# Altium project MK32_DSD.PrjPcb
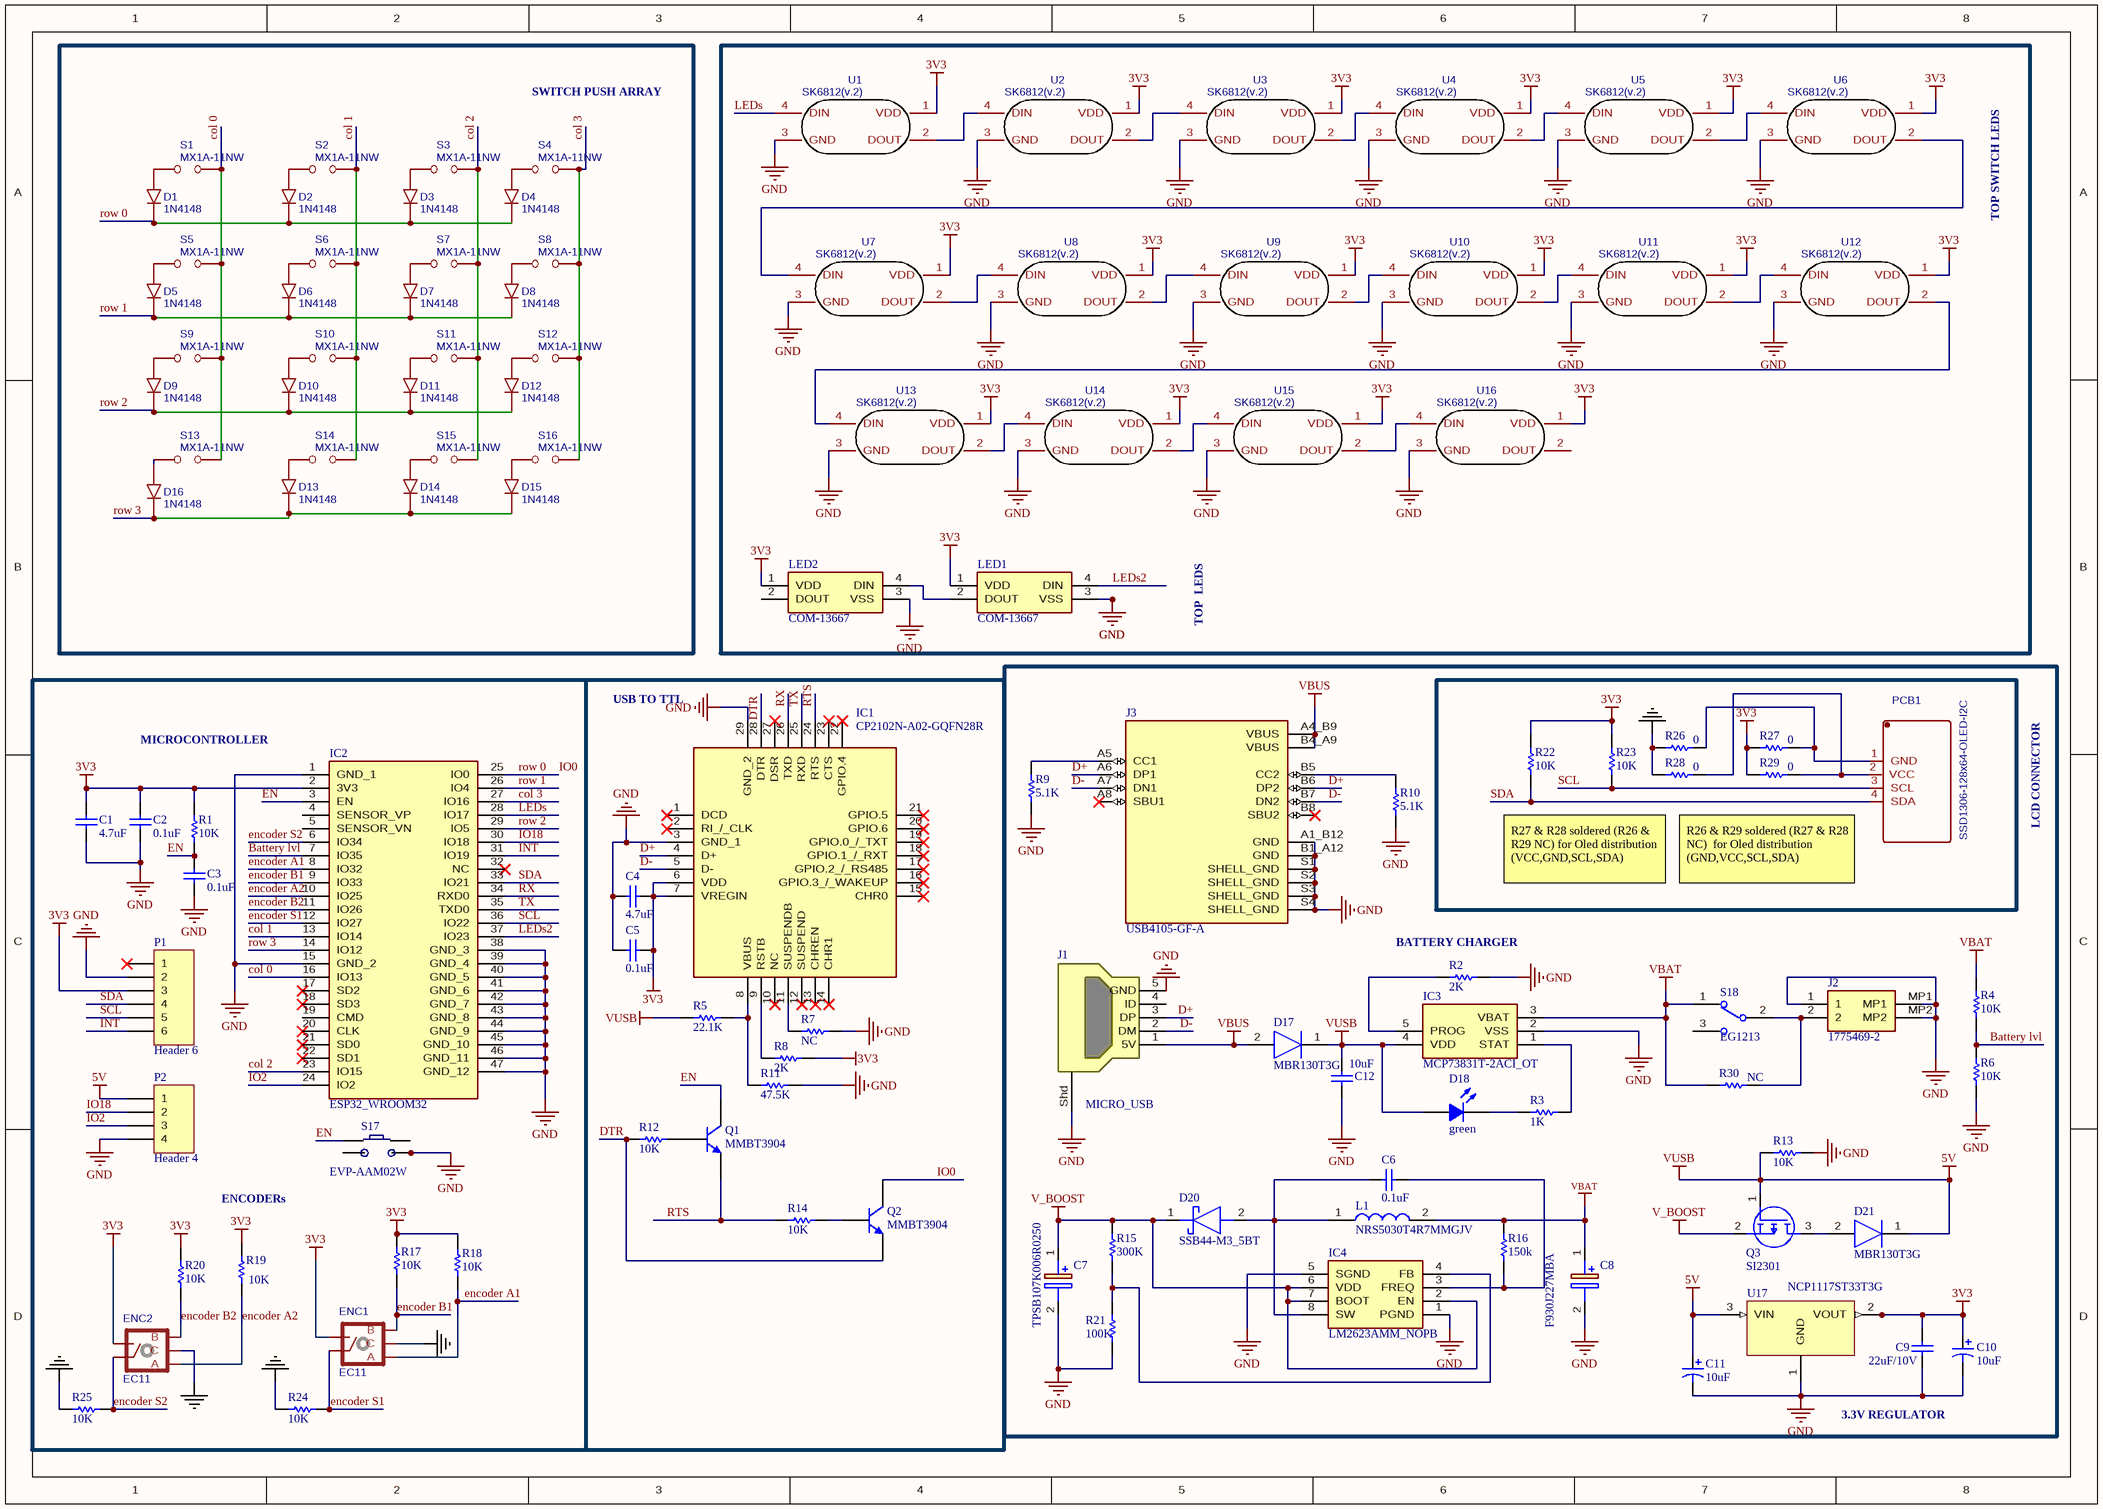
[diagram p0: Main.schdoc]
1 sheet, 115 parts. Net scope: global (net labels, ports and power ports of the same name join across sheets).
Board files: pcb_mk32_dsd_2022-03-23.pcbdoc, DeepDeckBack.PcbDoc, DeepDeckKeyHolder.PcbDoc

## Sheet Main.schdoc
size A3; SheetNumber: 1; SheetTotal: 1

### Parts
C1  4.7uF  [C0603_N]
C2  0.1uF  [C0603_N]
C3  0.1uF  [C0603_N]
C4  4.7uF  [C0603_N]
C5  0.1uF  [C0603_N]
C6  0.1uF  [C0603_N]
C7  TPSB107K006R0250  [CAPPM3528X210N]
C8  F930J227MBA  [CAPPM3528X210N]
C9  22uF/10V  [C1206_M]
C10  10uF  [C_TANT_A_3216_N]
C11  10uF  [C_TANT_A_3216_N]
C12  10uF  [C0805_N]
D1  1N4148  [SOD123_N]
D2  1N4148  [SOD123_N]
D3  1N4148  [SOD123_N]
D4  1N4148  [SOD123_N]
D5  1N4148  [SOD123_N]
D6  1N4148  [SOD123_N]
D7  1N4148  [SOD123_N]
D8  1N4148  [SOD123_N]
D9  1N4148  [SOD123_N]
D10  1N4148  [SOD123_N]
D11  1N4148  [SOD123_N]
D12  1N4148  [SOD123_N]
D13  1N4148  [SOD123_N]
D14  1N4148  [SOD123_N]
D15  1N4148  [SOD123_N]
D16  1N4148  [SOD123_N]
D17  MBR130T3G  [SOD3716X135N]
D18  green  [D0603_L]
D20  SSB44-M3_5BT  [DIOM5436X244N]
D21  MBR130T3G  [SOD3716X135N]
ENC1  EC11  [EC11]
ENC2  EC11  [EC11]
IC1  CP2102N-A02-GQFN28R  [QFN50P500X500X80-29N-D]
IC2  ESP32_WROOM32  [ESP32WROOM32]
IC3  MCP73831T-2ACI_OT  [SOT95P270X145-5N]
IC4  LM2623AMM_NOPB  [SOP65P490X110-8N]
J1  MICRO_USB  [USB MICRO]
J2  1775469-2  [17754692]
J3  USB4105-GF-A  [GCT_USB4105-GF-A]
L1  NRS5030T4R7MMGJV  [NRS5030T4R7MMGJV]
LED1  COM-13667  [COM13667]
LED2  COM-13667  [COM13667]
P1  Header 6  [HDR1X6]
P2  Header 4  [HDR1X4]
PCB1  SSD1306-128x64-OLED-I2C  [SSD1306_GNDVCC]
Q1  MMBT3904  [SOT23_N]
Q2  MMBT3904  [SOT23_N]
Q3  SI2301  [SOT95P240X120-3N]
R1  10K  [R0603_N]
R2  2K  [R0603_L]
R3  1K  [R0603_L]
R4  10K  [R0603_N]
R5  22.1K  [R0603_N]
R6  10K  [R0603_N]
R7  NC  [R0603_N]
R8  2K  [R0603_N]
R9  5.1K  [R0603_N]
R10  5.1K  [R0603_N]
R11  47.5K  [R0603_N]
R12  10K  [R0603_N]
R13  10K  [R0603_N]
R14  10K  [R0603_N]
R15  300K  [R0603_N]
R16  150k  [R0603_N]
R17  10K  [R0603_N]
R18  10K  [R0603_N]
R19  10K  [R0603_N]
R20  10K  [R0603_N]
R21  100K  [R0603_N]
R22  10K  [R0603_N]
R23  10K  [R0603_N]
R24  10K  [R0603_N]
R25  10K  [R0603_N]
R26  0  [R0402_M]
R27  0  [R0402_M]
R28  0  [R0402_M]
R29  0  [R0402_M]
R30  NC  [R0603_N]
S1  MX1A-11NW  [Kailh 1350 socket]
S2  MX1A-11NW  [Kailh 1350 socket]
S3  MX1A-11NW  [Kailh 1350 socket]
S4  MX1A-11NW  [Kailh 1350 socket]
S5  MX1A-11NW  [Kailh 1350 socket]
S6  MX1A-11NW  [Kailh 1350 socket]
S7  MX1A-11NW  [Kailh 1350 socket]
S8  MX1A-11NW  [Kailh 1350 socket]
S9  MX1A-11NW  [Kailh 1350 socket]
S10  MX1A-11NW  [Kailh 1350 socket]
S11  MX1A-11NW  [Kailh 1350 socket]
S12  MX1A-11NW  [Kailh 1350 socket]
S13  MX1A-11NW  [Kailh 1350 socket]
S14  MX1A-11NW  [Kailh 1350 socket]
S15  MX1A-11NW  [Kailh 1350 socket]
S16  MX1A-11NW  [Kailh 1350 socket]
S17  EVP-AAM02W  [EVPAAM02W]
S18  EG1213  [SK-12D02-VG5]
U1  SK6812(v.2)  [SK6812MINI-E]
U2  SK6812(v.2)  [SK6812MINI-E]
U3  SK6812(v.2)  [SK6812MINI-E]
U4  SK6812(v.2)  [SK6812MINI-E]
U5  SK6812(v.2)  [SK6812MINI-E]
U6  SK6812(v.2)  [SK6812MINI-E]
U7  SK6812(v.2)  [SK6812MINI-E]
U8  SK6812(v.2)  [SK6812MINI-E]
U9  SK6812(v.2)  [SK6812MINI-E]
U10  SK6812(v.2)  [SK6812MINI-E]
U11  SK6812(v.2)  [SK6812MINI-E]
U12  SK6812(v.2)  [SK6812MINI-E]
U13  SK6812(v.2)  [SK6812MINI-E]
U14  SK6812(v.2)  [SK6812MINI-E]
U15  SK6812(v.2)  [SK6812MINI-E]
U16  SK6812(v.2)  [SK6812MINI-E]
U17  NCP1117ST33T3G  [SOT-223_M]

### Blocks framed on the sheet
SWITCH PUSH ARRAY: D1-D16 S1-S16
USB TO TTL: C4 C5 IC1 Q1 Q2 R5 R7 R8 R11 R12 R14

### Nets
3V3: C1.2 C2.2 C4.1 C5.1 C9.2 C10.1 ENC1.2 ENC2.2 IC1.6(VDD) IC1.7(VREGIN) IC2.2(3V3) LED1.1(VDD) LED2.1(VDD) P1.3 R1.2 R8.1 R17.2 R18.2 R19.2 R20.2 R22.2 R23.2 R27.2 R29.2 U1.1(VDD) U2.1(VDD) U3.1(VDD) U4.1(VDD) U5.1(VDD) U6.1(VDD) U7.1(VDD) U8.1(VDD) U9.1(VDD) U10.1(VDD) U11.1(VDD) U12.1(VDD) U13.1(VDD) U14.1(VDD) U15.1(VDD) U16.1(VDD) U17.2(VOUT) U17.4(VOUT)
5V: C11.1 C12.2 D17.1(K) D18.2(A) D21.1(K) IC3.4(VDD) P2.1 Q3.1(G) R5.1 R13.1 U17.3(VIN)  [also labelled VUSB]
GND: C1.1 C2.1 C3.1 C4.2 C5.2 C7.2(-) C8.2(-) C9.1 C10.2 C11.2 C12.1 ENC1.5(C) ENC2.5(C) IC1.3(GND_1) IC1.29(GND_2) IC2.1(GND_1) IC2.15(GND_2) IC2.38(GND_3) IC2.39(GND_4) IC2.40(GND_5) IC2.41(GND_6) IC2.42(GND_7) IC2.43(GND_8) IC2.44(GND_9) IC2.45(GND_10) IC2.46(GND_11) IC2.47(GND_12) IC3.2(VSS) IC4.1(PGND) IC4.5(SGND) J1.5(GND) J1.Shd J2.1 J2.MP1 J2.MP2 J3.A1_B12(GND) J3.B1_A12(GND) J3.S1(SHELL_GND) J3.S2(SHELL_GND) J3.S3(SHELL_GND) J3.S4(SHELL_GND) LED1.3(VSS) LED2.3(VSS) P1.2 P2.4 R2.1 R6.1 R7.1 R9.1 R10.1 R11.1 R13.2 R21.1 R24.2 R25.2 R26.2 R28.2 S17.B2(COM_2) U1.3(GND) U2.3(GND) U3.3(GND) U4.3(GND) U5.3(GND) U6.3(GND) U7.3(GND) U8.3(GND) U9.3(GND) U10.3(GND) U11.3(GND) U12.3(GND) U13.3(GND) U14.3(GND) U15.3(GND) U16.3(GND) U17.1(GND)
V_BOOST: C7.1(+) D20.1(K) IC4.2(EN) IC4.6(VDD) IC4.7(BOOT) Q3.2(S) R15.2
VBAT: C8.1(+) IC3.3(VBAT) L1.2 R4.2 R16.2 R30.2 S18.1
VBUS: D17.2(A) J1.1(5V) J3.A4_B9(VBUS) J3.B4_A9(VBUS)
Battery lvl: IC2.7(IO35) R4.1 R6.2
col 0: IC2.16(IO13) S1.2 S5.2 S9.2 S13.2
col 1: IC2.13(IO14) S2.2 S6.2 S10.2 S14.2
col 2: IC2.23(IO15) S3.2 S7.2 S11.2 S15.2
col 3: IC2.27(IO16) S4.2 S8.2 S12.2 S16.2
D+: IC1.4(D+) J1.3(DP) J3.A6(DP1) J3.B6(DP2)
D-: IC1.5(D-) J1.2(DM) J3.A7(DN1) J3.B7(DN2)
DTR: IC1.28(DTR) Q2.2(E) R12.1
EN: C3.2 IC2.3(EN) Q1.3(C) R1.1 S17.A1(NO_1)
encoder A1: ENC1.3(A) IC2.8(IO32) R18.1
encoder A2: ENC2.3(A) IC2.10(IO25) R19.1
encoder B1: ENC1.4(B) IC2.9(IO33) R17.1
encoder B2: ENC2.4(B) IC2.11(IO26) R20.1
encoder S1: ENC1.1 IC2.12(IO27) R24.1
encoder S2: ENC2.1 IC2.6(IO34) R25.1
INT: IC2.31(IO19) P1.6
IO0: D1.2 D2.2 D3.2 D4.2 IC2.25(IO0) Q2.3(C)  [also labelled row 0]
IO2: IC2.24(IO2) P2.3
IO18: IC2.30(IO18) P2.2
LEDs: IC2.28(IO17) U1.4(DIN)
LEDs2: IC2.37(IO23) LED1.4(DIN)
row 1: D5.2 D6.2 D7.2 D8.2 IC2.26(IO4)
row 2: D9.2 D10.2 D11.2 D12.2 IC2.29(IO5)
row 3: D13.2 D14.2 D15.2 D16.2 IC2.14(IO12)
RTS: IC1.24(RTS) Q1.2(E) R14.2
RX: IC1.26(TXD) IC2.34(RXD0)
SCL: IC2.36(IO22) P1.5 PCB1.3(SCL) R23.1
SDA: IC2.33(IO21) P1.4 PCB1.4(SDA) R22.1
TX: IC1.25(RXD) IC2.35(TXD0)
NetC6_1: C6.1 D20.2(A) IC4.8(SW) L1.1
NetC6_2: C6.2 IC4.3(FREQ) R16.1
NetD1_1: D1.1 S1.1
NetD2_1: D2.1 S2.1
NetD3_1: D3.1 S3.1
NetD4_1: D4.1 S4.1
NetD5_1: D5.1 S5.1
NetD6_1: D6.1 S6.1
NetD7_1: D7.1 S7.1
NetD8_1: D8.1 S8.1
NetD9_1: D9.1 S9.1
NetD10_1: D10.1 S10.1
NetD11_1: D11.1 S11.1
NetD12_1: D12.1 S12.1
NetD13_1: D13.1 S14.1
NetD14_1: D14.1 S15.1
NetD15_1: D15.1 S16.1
NetD16_1: D16.1 S13.1
NetD18_1: D18.1(K) R3.2
NetD21_2: D21.2(A) Q3.3(D)
NetIC1_8: IC1.8(VBUS) R5.2 R11.2
NetIC1_9: IC1.9(RSTB) R8.2
NetIC1_11: IC1.11(SUSPENDB) R7.2
NetIC3_1: IC3.1(STAT) R3.1
NetIC3_5: IC3.5(PROG) R2.2
NetIC4_4: IC4.4(FB) R15.1 R21.2
NetJ2_2: J2.2 R30.1 S18.2
NetJ3_A5: J3.A5(CC1) R9.2
NetJ3_B5: J3.B5(CC2) R10.2
NetLED1_2: LED1.2(DOUT) LED2.4(DIN)
NetPCB1_1: PCB1.1(GND) R26.1 R27.1
NetPCB1_2: PCB1.2(VCC) R28.1 R29.1
NetQ1_1: Q1.1(B) R12.2
NetQ2_1: Q2.1(B) R14.1
NetU1_2: U1.2(DOUT) U2.4(DIN)
NetU2_2: U2.2(DOUT) U3.4(DIN)
NetU3_2: U3.2(DOUT) U4.4(DIN)
NetU4_2: U4.2(DOUT) U5.4(DIN)
NetU5_2: U5.2(DOUT) U6.4(DIN)
NetU6_2: U6.2(DOUT) U7.4(DIN)
NetU7_2: U7.2(DOUT) U8.4(DIN)
NetU8_2: U8.2(DOUT) U9.4(DIN)
NetU9_2: U9.2(DOUT) U10.4(DIN)
NetU10_2: U10.2(DOUT) U11.4(DIN)
NetU11_2: U11.2(DOUT) U12.4(DIN)
NetU12_2: U12.2(DOUT) U13.4(DIN)
NetU13_2: U13.2(DOUT) U14.4(DIN)
NetU14_2: U14.2(DOUT) U15.4(DIN)
NetU15_2: U15.2(DOUT) U16.4(DIN)

Not connected (* = marked no-connect by the designer): IC1 1(DCD)* 2(RI_/_CLK)* 10(NC)* 12(SUSPEND)* 13(CHREN)* 14(CHR1)* 15(CHR0)* 16(GPIO.3_/_WAKEUP)* 17(GPIO.2_/_RS485)* 18(GPIO.1_/_RXT)* 19(GPIO.0_/_TXT)* 20(GPIO.6)* 21(GPIO.5)* 22(GPIO.4)* 23(CTS)* 27(DSR)*; IC2 4(SENSOR_VP) 5(SENSOR_VN) 17(SD2)* 18(SD3)* 19(CMD) 20(CLK)* 21(SD0)* 22(SD1)* 32(NC)*; J1 4(ID); J3 A8(SBU1)* B8(SBU2)*; LED2 2(DOUT); P1 1*; S17 A2(COM_1) B1(NO_2); S18 3; U16 2(DOUT)

### Notes on the sheet
- TOP SWITCH LEDS
- TOP  LEDS
- MICROCONTROLLER
- LCD CONNECTOR
- R27 & R28 soldered (R26 & R29 NC) for Oled distribution (VCC,GND,SCL,SDA)
- R26 & R29 soldered (R27 & R28 NC)  for Oled distribution (GND,VCC,SCL,SDA)
- (near R2) BATTERY CHARGER
- ENCODERs
- 3.3V REGULATOR

### Library data of the parts
C1-C6 C9 C12 = C_SMD
  C1 C4: Value: 4.7uF
  C2 C3 C5 C6: Value: 0.1uF
  C9: Value: 22uF/10V
  C12: Value: 10uF
C7 = TPSB107K006R0250: Capacitor Polarised; Manufacturer_Name: AVX; Datasheet Link: http://datasheets.avx.com/TPS.pdf; Height: 2.1mm; Manufacturer_Part_Number: TPSB107K006R0250; Mouser Part Number: 581-TPSB107K006R0250; Mouser Price/Stock: https://www.mouser.co.uk/ProductDetail/AVX/TPSB107K006R0250?qs=im0Xcs1C0VUGGXHMJDxv8A%3D%3D; Arrow Part Number: TPSB107K006R0250; Arrow Price/Stock: https://www.arrow.com/en/products/tpsb107k006r0250/avx?region=nac
C8 = F930J227MBA: Capacitor Polarised; Manufacturer_Name: AVX; Datasheet Link: https://www.mouser.com/datasheet/2/40/f93-776559.pdf; Height: 2.1mm; Manufacturer_Part_Number: F930J227MBA; Mouser Part Number: 647-F930J227MBA; Mouser Price/Stock: https://www.mouser.com/Search/Refine.aspx?Keyword=647-F930J227MBA; Arrow Part Number: F930J227MBA; Arrow Price/Stock: https://www.arrow.com/en/products/f930j227mba/avx
C10 C11 = CP_SMD: Value: 10uF
D1-D16 = 1N4148TA: BOM_Manufacturer: FAIRCHILD; Contributor: LCSC; BOM_Supplier: LCSC; BOM_Manufacturer Part: 1N4148TA; spicePre: D; BOM_Supplier Part: C124481
D17 D21 = MBR130T3G: Diode; Manufacturer_Name: ON Semiconductor; Datasheet Link: http://www.onsemi.com/pub/Collateral/MBR130T1-D.PDF; Height: 1.35mm; Manufacturer_Part_Number: MBR130T3G; Mouser Part Number: 863-MBR130T3G; Mouser Price/Stock: https://www.mouser.co.uk/ProductDetail/ON-Semiconductor/MBR130T3G?qs=3JMERSakeboBlzSl4dGpZQ%3D%3D; Arrow Part Number: MBR130T3G; Arrow Price/Stock: https://www.arrow.com/en/products/mbr130t3g/on-semiconductor?region=nac
D18 = LED_SMD: Color: green
D20 = SSB44-M3_5BT: Schottky Diode; Manufacturer_Name: Vishay; Manufacturer_Part_Number: SSB44-M3/5BT; Datasheet Link: https://componentsearchengine.com/Datasheets/1/SSB44-M3_5BT.pdf; Height: 2.44mm; Mouser Part Number: 78-SSB44-M35BT; Mouser Price/Stock: https://www.mouser.com/Search/Refine.aspx?Keyword=78-SSB44-M35BT
ENC1 ENC2 = EC11: sourceId: _kcy86s1ZJ; BOM_Manufacturer Part: ?; spicePre: E
IC1 = CP2102N-A02-GQFN28R: Integrated Circuit; Manufacturer_Name: Silicon Labs; Datasheet Link: https://www.silabs.com/documents/public/data-sheets/cp2102n-datasheet.pdf; Height: 0.8mm; Manufacturer_Part_Number: CP2102N-A02-GQFN28R; Mouser Part Number: 634-CP2102NA02QFN28R; Mouser Price/Stock: https://www.mouser.co.uk/ProductDetail/Silicon-Labs/CP2102N-A02-GQFN28R?qs=u16ybLDytRag4qKvSH3fTw%3D%3D; Arrow Part Number: CP2102N-A02-GQFN28R; Arrow Price/Stock: https://www.arrow.com/en/products/cp2102n-a02-gqfn28r/silicon-labs
IC2 = ESP32_WROOM32: Integrated Circuit; Manufacturer_Name: Espressif Systems; Manufacturer_Part_Number: ESP32 WROOM32; Datasheet Link: https://www.espressif.com/sites/default/files/documentation/esp32-wroom-32_datasheet_en.pdf; Height: 3.2mm
IC3 = MCP73831T-2ACI_OT: Integrated Circuit; Manufacturer_Name: Microchip; Manufacturer_Part_Number: MCP73831T-2ACI/OT; Datasheet Link: http://ww1.microchip.com/downloads/en/DeviceDoc/20001984g.pdf; Height: 1.45mm; Mouser Part Number: 579-MCP73831T-2ACIOT; Mouser Price/Stock: https://www.mouser.co.uk/ProductDetail/Microchip-Technology/MCP73831T-2ACI-OT?qs=yUQqVecv4qvbBQBGbHx0Mw%3D%3D; Arrow Part Number: MCP73831T-2ACI/OT; Arrow Price/Stock: https://www.arrow.com/en/products/mcp73831t-2aciot/microchip-technology?region=nac
IC4 = LM2623AMM_NOPB: Integrated Circuit; Manufacturer_Name: Texas Instruments; Manufacturer_Part_Number: LM2623AMM/NOPB; Datasheet Link: http://www.ti.com/lit/ds/symlink/lm2623.pdf; Height: 1.1mm; Mouser Part Number: 926-LM2623AMM/NOPB; Mouser Price/Stock: https://www.mouser.co.uk/ProductDetail/Texas-Instruments/LM2623AMM-NOPB?qs=X1J7HmVL2ZHUXFRmS%252BHhFg%3D%3D; Arrow Part Number: LM2623AMM/NOPB; Arrow Price/Stock: https://www.arrow.com/en/products/lm2623ammnopb/texas-instruments
J1 = MICRO_USB: CONN USB MICRO B RECPT SMT R/A; Manufacturer: FCI; Manufacturer Part Number: 10118194-0001LF; Connector Type: USB - micro B; Number of Contacts: 5; Gender: Receptacle; Specifications: USB 2.0; Supplier 1: Digi-Key; RoHS: RoHS Compliant; Category: Connectors, Interconnects; Stock 1: 9139; Pricing 1: 1=0.46, 10=0.433, 25=0.3712, 50=0.3156, 100=0.3032, 250=0.27224, 500=0.25988 (USD); Packaging: Cut Tape (CT); Mounting Type: Surface Mount, Right Angle, Horizontal; Features: Shielded, Solder Retention; Ingress Protection: -; ComponentLink1URL: http://portal.fciconnect.com/Comergent//fci/drawing/10118194.pdf; ComponentLink1Description: http://portal.fciconnect.com/Comergent//fci/drawing/10118194.pdf; Supplier Part Number 1: 609-4618-1-ND
J2 = 1775469-2: Connector; Manufacturer_Name: TE Connectivity; Datasheet Link: https://www.te.com/commerce/DocumentDelivery/DDEController?Action=showdoc&DocId=Customer+Drawing%7F1775469%7FA5%7Fpdf%7FEnglish%7FENG_CD_1775469_A5.pdf%7F1775469-2; Height: 5.65mm; Manufacturer_Part_Number: 1775469-2; Mouser Part Number: 571-1775469-2; Mouser Price/Stock: https://www.mouser.co.uk/ProductDetail/TE-Connectivity/1775469-2/?qs=fvVej%2FMj3jdYOde%252BssG5lg%3D%3D; Arrow Part Number: 1775469-2; Arrow Price/Stock: https://www.arrow.com/en/products/1775469-2/te-connectivity
J3 = USB4105-GF-A: USB-C (USB TYPE-C) USB 2.0 Receptacle Connector 24 (16+8 Dummy) Position Surface Mount, Right Angle; Through Hole; MF: {'manufacturer': u'GCT'}; Package: None; Value: *; MP: USB4105-GF-A; Price: None; Availability: Unavailable
L1 = NRS5030T4R7MMGJV: Inductor; Manufacturer_Name: TAIYO YUDEN; Datasheet Link: https://ds.yuden.co.jp/TYCOMPAS/ut/detail?pn=NRS5030T4R7MMGJV  &u=M; Height: 3.1mm; Manufacturer_Part_Number: NRS5030T4R7MMGJV; Mouser Part Number: 963-NRS5030T4R7MMGJV; Mouser Price/Stock: https://www.mouser.co.uk/ProductDetail/Taiyo-Yuden/NRS5030T4R7MMGJV?qs=DpxmIIQLg%252BNSNpeBoQ6aww%3D%3D; Arrow Part Number: NRS5030T4R7MMGJV; Arrow Price/Stock: https://www.arrow.com/en/products/nrs5030t4r7mmgjv/taiyo-yuden?region=nac
LED1 LED2 = COM-13667: LED; Manufacturer_Name: SparkFun; Datasheet Link: https://cdn.sparkfun.com/datasheets/BreakoutBoards/WS2812B.pdf; Height: 2mm; Manufacturer_Part_Number: COM-13667; Mouser Part Number: 474-COM-13667; Mouser Price/Stock: https://www.mouser.co.uk/ProductDetail/SparkFun/COM-13667?qs=WyAARYrbSnYuV74MbwnFXg%3D%3D; Arrow Part Number: COM-13667; Arrow Price/Stock: https://www.arrow.com/en/products/com-13667/sparkfun-electronics?region=nac
P1 = Header 6: Header, 6-Pin; LatestRevisionDate: 17-Jul-2002; LatestRevisionNote: Re-released for DXP Platform.; Publisher: Altium Limited
P2 = Header 4: Header, 4-Pin; LatestRevisionDate: 17-Jul-2002; LatestRevisionNote: Re-released for DXP Platform.; Publisher: Altium Limited
PCB1 = SSD1306-128x64-OLED-I2C: sourceId: wICUcuL3l; spicePre: X; timeStamp: 1456014235; BOM_Manufacturer Part: ?
Q1 Q2 = MMBT3904: NPN Switching Transistor; Manufacturer: Micro Commercial Co; Manufacturer Part Number: MMBT3904-TP; Current - Collector (Ic) (Max): 200mA; Voltage - Collector Emitter Breakdown (Max): 40V; Vce Saturation (Max) @ Ib, Ic: 300mV @ 5mA, 50mA; DC Current Gain (hFE) (Min) @ Ic, Vce: 100 @ 10mA, 1V; Power - Max: 350mW; Frequency - Transition: 300MHz; Published: 17-Sep-2003; LatestRevisionDate: 12-Dec-2006; LatestRevisionNote: IPC-7351 Footprint Added.; DatasheetVersion: 13-May-2002; PackageVersion: May-1999; PackageReference: SOT23; Publisher: Altium Limited; PackageDescription: 3-Pin SOT-23 Package 0.95 mm Pitch, 2.3 mm Lead Span; ComponentLink1Description: Manufacturer Link; ComponentLink1URL: http://www.semiconductors.philips.com/; ComponentLink2Description: Datasheet; ComponentLink2URL: http://www.semiconductors.philips.com/acrobat/datasheets/MMBT3904_4.pdf; Supplier 1: Digi-Key; RoHS: RoHS Compliant; Category: Discrete Semiconductor Products; Stock 1: 101484; Pricing 1: 1=0.14, 10=0.127, 25=0.116, 100=0.0834, 250=0.04916, 500=0.04078, 1000=0.02781 (USD); Packaging: Cut Tape (CT); Transistor Type: NPN; Current - Collector Cutoff (Max): -; Mounting Type: Surface Mount; Package / Case: TO-236-3, SC-59, SOT-23-3; Supplier Device Package: SOT-23; ComponentLink3URL: http://www.mccsemi.com/up_pdf/MMBT3904(SOT-23).pdf; ComponentLink3Description: http://www.mccsemi.com/up_pdf/MMBT3904(SOT-23).pdf; Supplier Part Number 1: MMBT3904TPMSCT-ND
Q3 = SI2301: MOSFET (P-Channel); Manufacturer_Name: PUOLOP; Datasheet Link: https://datasheet.lcsc.com/szlcsc/1901091236_PUOLOP-SI2301_C351397.pdf; Height: 1.2mm; Manufacturer_Part_Number: SI2301
R1-R30 = R_SMD
  R1 R4 R6 R12-R14 R17-R20 R22-R25: Value: 10K
  R2 R8: Value: 2K
  R3: Value: 1K
  R5: Value: 22.1K
  R7 R30: Value: NC
  R9 R10: Value: 5.1K
  R11: Value: 47.5K
  R15: Value: 300K
  R16: Value: 150k
  R21: Value: 100K
  R26-R29: Value: 0
S17 = EVP-AAM02W: Switch; Manufacturer_Name: Panasonic; Allied_Number: 70900257; Datasheet Link: https://industrial.panasonic.com/cdbs/www-data/pdf/ATK0000/ATK0000C372.pdf; Height: 1.9mm; Manufacturer_Part_Number: EVP-AAM02W; Mouser Part Number: 667-EVP-AAM02W; Mouser Price/Stock: https://www.mouser.com/Search/Refine.aspx?Keyword=667-EVP-AAM02W; Allied Price/Stock: https://www.alliedelec.com/panasonic-evp-aam02w/70900257/
S18 = EG1213: <b>EG Series SPDT On-On Right Angle Through Hole Slide Switch</b>; MF: {'manufacturer': u'E-Switch'}; MP: EG1213; Value: *; Package: None; Price: None; Availability: Unavailable
U1-U16 = SK6812(v.2): Contributor: PetrSlachta; spicePre: U; spiceSymbolName: SK6812(v.2)
U17 = NCP1117ST33T3G: IC REG LINEAR 3.3V 1A SOT223; Manufacturer: ON Semiconductor; Output Configuration: Positive; Output Type: Fixed; Voltage - Input (Max): 20V; Voltage Dropout (Max): 1.2V @ 800mA; PSRR: 64dB (120Hz); Protection Features: Over Current, Over Temperature; Supplier 1: Digi-Key; Manufacturer Part Number: NCP1117ST33T3G; RoHS: RoHS Compliant; Category: Integrated Circuits (ICs); Stock 1: 49501; Pricing 1: 1=0.52, 10=0.444, 100=0.3315, 500=0.26048, 1000=0.20129 (USD); Packaging: Cut Tape (CT); Part Status: Active; Voltage - Output (Min/Fixed): 3.3V; Voltage - Output (Max): -; Current - Output: 1A; Control Features: -; Operating Temperature: 0°C ~ 125°C; Mounting Type: Surface Mount; Package / Case: TO-261-4, TO-261AA; Supplier Device Package: SOT-223; Base Part Number: NCP1117ST33; ComponentLink1URL: http://www.onsemi.com/pub/Collateral/NCP1117-D.PDF; ComponentLink1Description: http://www.onsemi.com/pub/Collateral/NCP1117-D.PDF; Supplier Part Number 1: NCP1117ST33T3GOSCT-ND
S1-S16 = MX1A-11NW: BOM_Manufacturer Part: MX1A-11NW; BOM_Supplier: Mouser; link: http://cherryamericas.com/wp-content/uploads/2014/12/mx_cat.pdf; spicePre: S; BOM_Supplier Part: 540-MX1A-11NW